# EAGLE design gaszähler (EAGLE 6.5.0)
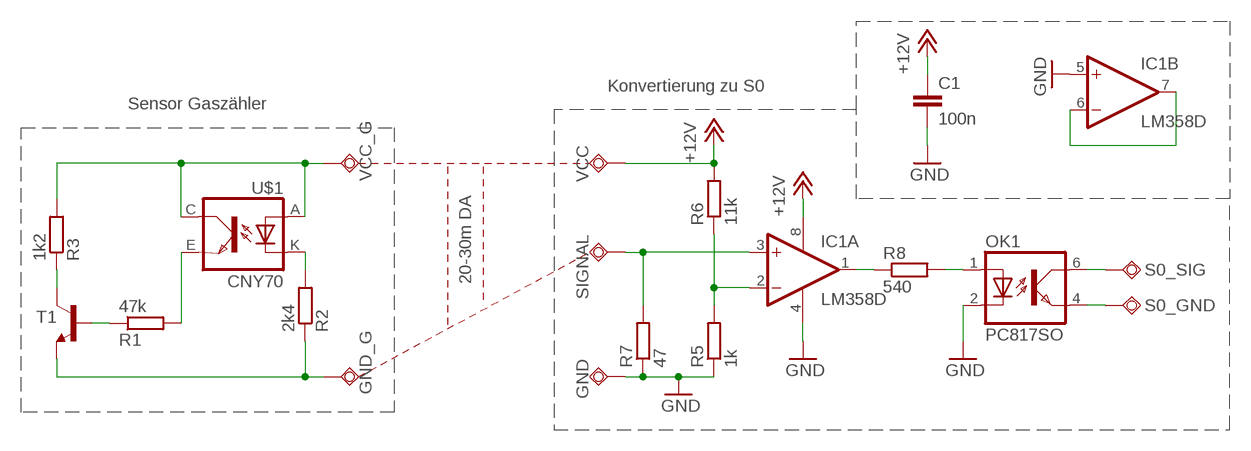
[diagram p0: schematic, sheet 1]

## Parts
C1  100n  C-EUC0805  [C0805]
GND  TPSQTP20SQ  [TP20SQ]
GND_G  TPSQTP20SQ  [TP20SQ]
IC1  LM358D  [SO08]
OK1  PC817SO  [SO4]
R1  47k  R-EU_R0805  [R0805]
R2  2k4  R-EU_R0805  [R0805]
R3  1k2  R-EU_R0805  [R0805]
R5  1k  R-EU_M0805  [M0805]
R6  11k  R-EU_M0805  [M0805]
R7  47  R-EU_M0805  [M0805]
R8  540  R-EU_M0805  [M0805]
S0_GND  TPSQTP20SQ  [TP20SQ]
S0_SIG  TPSQTP20SQ  [TP20SQ]
SIGNAL  TPSQTP20SQ  [TP20SQ]
T1  -NPN-SOT23-EBC  [SOT23-EBC]
U$1  CNY70  [4]
VCC  TPSQTP20SQ  [TP20SQ]
VCC_G  TPSQTP20SQ  [TP20SQ]

## Nets
+12V: C1.1 IC1.8(P:V+) R6.2 VCC.TP
GND: C1.2 GND.TP IC1.4(P:V-) IC1.5(B:+IN) OK1.2(C) R5.1 R7.1
GND_G: GND_G.TP R2.1 T1.E
N$1: IC1.2(A:-IN) R5.2 R6.1
N$2: R2.2 U$1.K(C)
N$3: R1.2 U$1.E(EMI)
N$5: IC1.3(A:+IN) R7.2 SIGNAL.TP
N$6: R1.1 T1.B
N$7: R3.1 T1.C
N$8: OK1.6(COL) S0_SIG.TP
N$9: IC1.1(A:OUT) R8.1
N$10: OK1.4(EMIT) S0_GND.TP
N$11: OK1.1(A) R8.2
N$13: IC1.6(B:-IN) IC1.7(B:OUT)
N$14: R3.2 U$1.A U$1.C(COL) VCC_G.TP

## Notes on the sheet
- Konvertierung zu S0
- Sensor Gaszähler
- 20-30m DA

## Library data of the parts
C1 = rcl:C-EU: CAPACITOR, European symbol
GND GND_G S0_GND S0_SIG SIGNAL VCC VCC_G = testpad:TPSQ: Test pad
IC1 = linear:LM358: OP AMP also LM158; LM258; LM2904 Source: http://cache.national.com/ds/LM/LM158.pdf
OK1 = optocoupler2:PC817: SHARP OPTO COUPLER
R1-R3 R5-R8 = rcl:R-EU_: RESISTOR, European symbol
T1 = transistor:*-NPN-: NPN Transistror BF959 corrected 2008.03.06
U$1 = cny70:CNY70

## Board
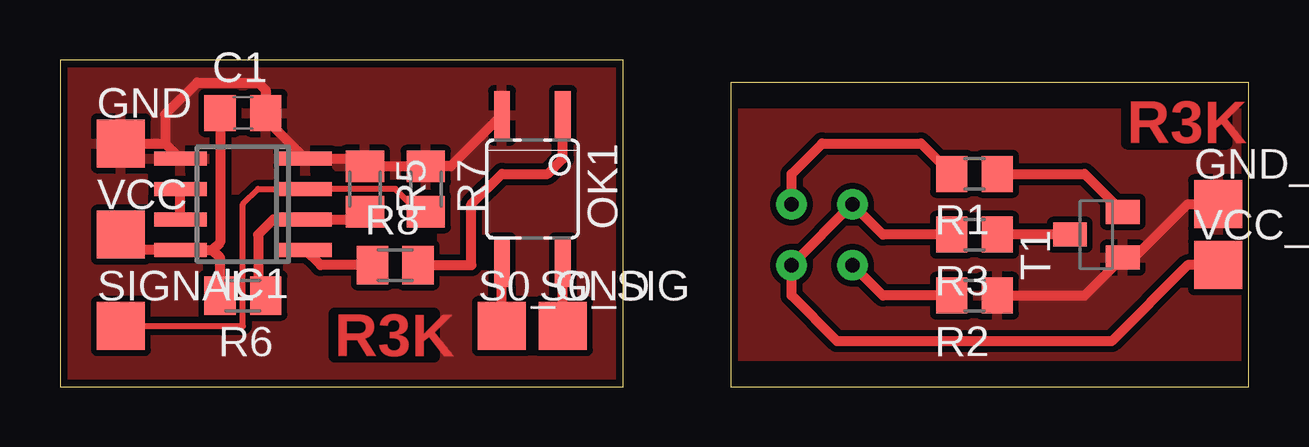
[diagram p1: board, top side]
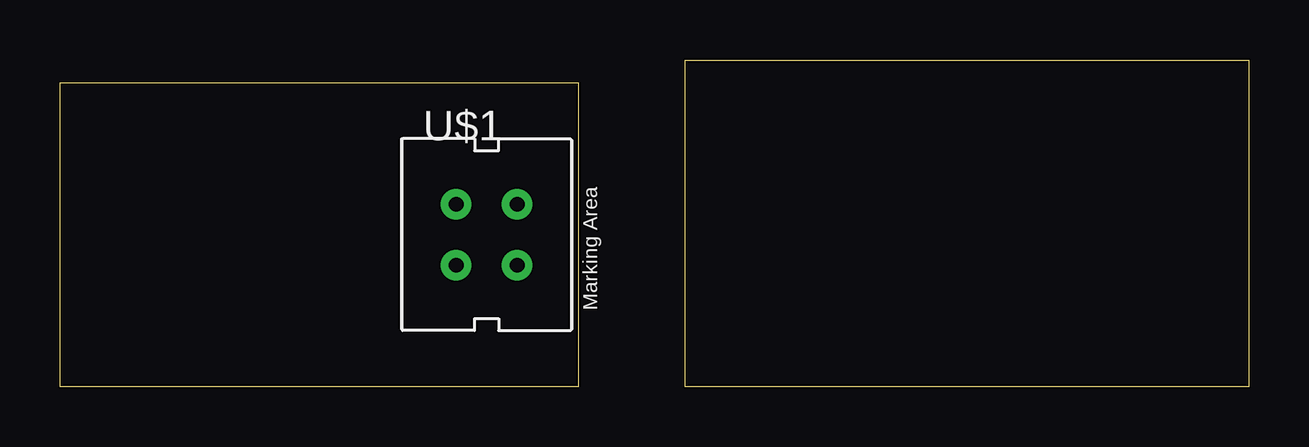
[diagram p2: board, bottom side, seen from below]

Size 49.53 x 13.64 mm. Coordinates in mm from the lower left corner, seen from the top.
Outline: 0,0 23.48,0 23.48,13.64 0,13.64 0,0
Outline: 27.94,0 49.53,0 49.53,12.7 27.94,12.7 27.94,0
Copper layers (1*16): Top 0.035mm / dielectric 1.5mm / Bottom 0.035mm
Design rules "default": minimum track width 10mil, minimum drill 24mil, track to track 10mil, track to pad 10mil, pad to pad 10mil, via to via 10mil, smd to smd 10mil, copper to edge 12mil, drill to drill 8mil, minimum pad ring 10mil, minimum via ring 8mil, stop-mask expansion 4mil, vias tented up to drill 0mil, thermal gap 10mil

### Footprints (pad centres in the part's own frame; a part is rotated, then mirrored left to right if it is on the bottom)
C0805 = smd 1.3 x 1.5: 1 -0.95,0; 2 0.95,0
TP20SQ = smd 2 x 2: TP 0,0
SO08 = smd 0.6 x 2.2: 1 -1.905,-2.6; 2 -0.635,-2.6; 3 0.635,-2.6; 4 1.905,-2.6; 5 1.905,2.6; 6 0.635,2.6; 7 -0.635,2.6; 8 -1.905,2.6
SO4 = smd 0.66 x 2.032: 1 -0.635,-3.073; 2 1.905,-3.073; 4 1.905,3.073; 6 -0.635,3.073
R0805 = smd 1.3 x 1.5: 1 -0.95,0; 2 0.95,0
M0805 = smd 1.3 x 1.6: 1 -0.95,0; 2 0.95,0
SOT23-EBC = smd 1 x 1.4: B 0.95,-1.1; C 0,1.1; E -0.95,-1.1
4 = drill 0.61 pad 1.27: A -1.27,1.27; C 1.27,-1.27; E 1.27,1.27; K -1.27,-1.27

### Placement (x,y rotation side)
C1  7.62,11.43 0 top
GND  2.54,10.16 0 top
GND_G  48.26,7.62 0 top
IC1  7.62,7.62 90 top
OK1  20.32,8.26 180 top
R1  38.1,8.89 180 top
R2  38.1,3.81 180 top
R3  38.1,6.35 180 top
R5  12.7,8.26 270 top
R6  7.62,3.81 180 top
R7  15.24,8.26 270 top
R8  13.97,5.08 0 top
S0_GND  18.41,2.54 0 top
S0_SIG  20.95,2.54 0 top
SIGNAL  2.54,2.54 0 top
T1  43.18,6.35 90 top
U$1  31.75,6.35 0 bottom
VCC  2.54,6.35 0 top
VCC_G  48.26,5.08 0 top

### Tracks (layer width: path | path; a pad name or v marks a point on that pad's centre or on a via)
+12V
  Top 0.406: C1.1 6.67,6.04 6.35,5.71 | VCC.TP 3.17,5.71 IC1.8 6.35,5.71 | R6.2 6.67,5.39 6.35,5.71
GND
  Top 0.406: OK1.2 16.29,9.21 R7.1 R5.1 arc90 12.38,9.53 IC1.4 8.57,11.18 C1.2 8.57,12.38 8.26,12.7 5.71,12.7 4.38,11.37 4.38,10.16 | GND.TP 4.38,10.16 | 4.38,10.16 IC1.5
  pour Top: -0.64,14.61 24.13,14.61 24.13,-0.64 -0.64,-0.64
GND_G
  Top 0.406: R2.1 42.69,3.81 T1.E 44.77,5.4 46.99,7.62 GND_G.TP
  pour Top: 27.94,11.43 49.53,11.43 49.53,1.27 27.94,1.27
N$1
  Top 0.406: R5.2 12.38,6.99 IC1.2 8.89,6.99 8.26,6.35 8.26,4.12 R6.1
N$2
  Top 0.406: R2.2 34.29,3.81 U$1.K
N$3
  Top 0.406: U$1.E 30.48,8.89 31.75,10.16 35.88,10.16 R1.2
N$5
  Top 0.254: SIGNAL.TP 7.62,2.54 7.62,7.62 8.26,8.26 IC1.3 13.97,8.26 14.92,7.3 R7.2
N$6
  Top 0.406: R1.1 42.69,8.89 T1.B
N$7
  Top 0.406: T1.C R3.1
N$8
  Top 0.406: S0_SIG.TP OK1.6
N$9
  Top 0.406: R8.1 10.86,5.08 IC1.1
N$10
  Top 0.406: S0_GND.TP OK1.4
N$11
  Top 0.406: R8.2 17.14,5.08 17.14,7.62 18.41,8.89 20.32,8.89 20.95,9.53 OK1.1
N$13
  Top 0.406: IC1.7 IC1.6
N$14
  Top 0.406: R3.2 34.29,6.35 U$1.A U$1.C 30.48,3.81 32.38,1.91 43.81,1.91 46.99,5.08 VCC_G.TP

### Text on the board
Top: R3K | R3K